# Altium schematic sheet Node.SchDoc
size A
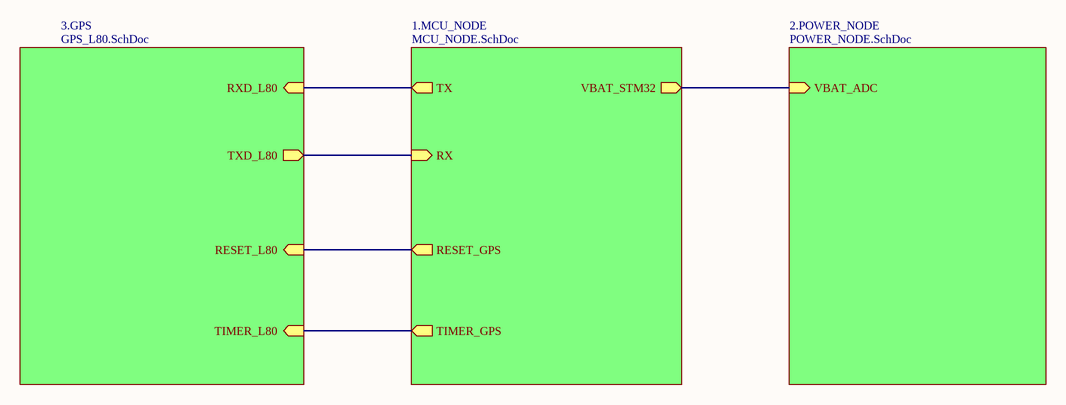
[diagram p0: Node.SchDoc]

## Sub-sheets
1.MCU_NODE = MCU_NODE.SchDoc: TX (out), VBAT_STM32 (out), RX (in), RESET_GPS (out), TIMER_GPS (out)
2.POWER_NODE = POWER_NODE.SchDoc: VBAT_ADC (in)
3.GPS = GPS_L80.SchDoc: RXD_L80 (in), TXD_L80 (out), RESET_L80 (in), TIMER_L80 (in)

## Nets
(unnamed): sheet 1.MCU_NODE/TX, sheet 3.GPS/RXD_L80
(unnamed): sheet 1.MCU_NODE/VBAT_STM32, sheet 2.POWER_NODE/VBAT_ADC
(unnamed): sheet 1.MCU_NODE/RX, sheet 3.GPS/TXD_L80
(unnamed): sheet 1.MCU_NODE/RESET_GPS, sheet 3.GPS/RESET_L80
(unnamed): sheet 1.MCU_NODE/TIMER_GPS, sheet 3.GPS/TIMER_L80